# Altium project Nixie_IN12.PrjPcb
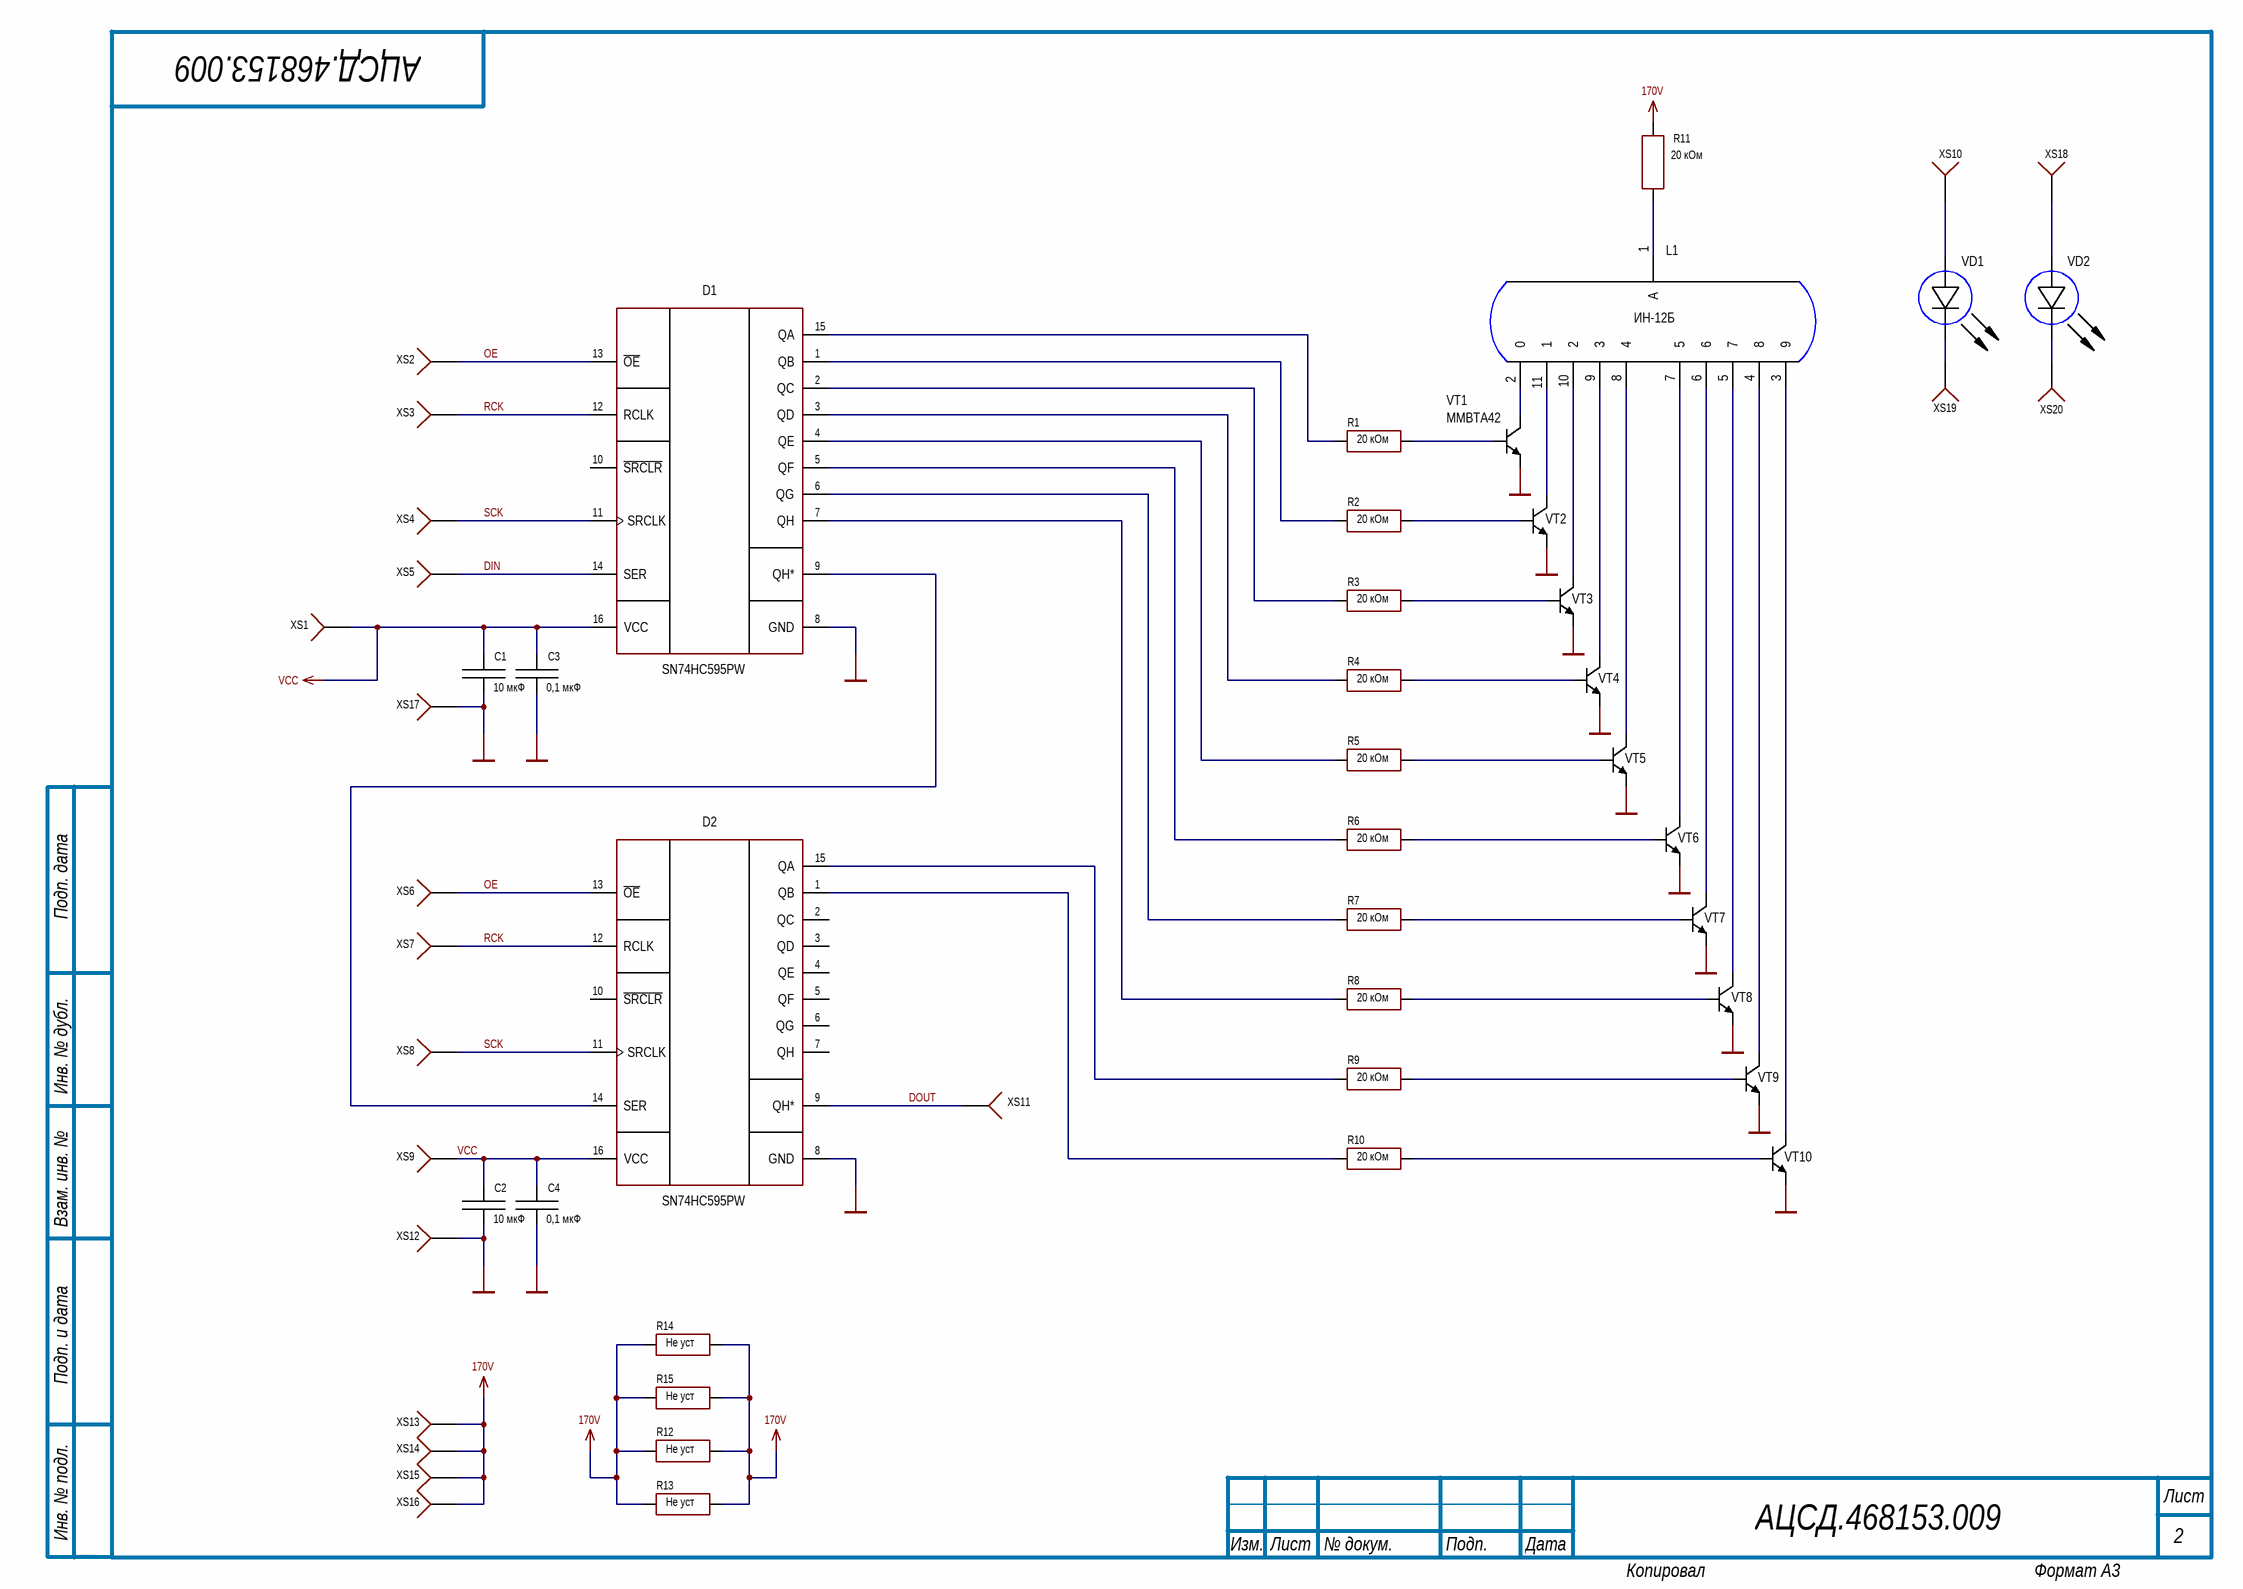
[diagram p0: Nixie_IN12.SchDoc]
Дата_изменения: 22.07.2020; Наименование: Плата управления; Наименование1: Плата управления; Наименование_PCB: Плата печатная; Обозначение: АЦСД.468153.009; Обозначение_PCB: АЦСД.758764.017; Обозначение_Код: АЦСД.468153.009; Перв.Примен.: АЦСД.468153.009; ПервПримен: АЦСД.468153.009; Раздел: Документация; Раздел_PCB: Документация; Формат_PCB: А4
1 sheet, 54 parts. Net scope: global (net labels, ports and power ports of the same name join across sheets).
Board file: Nixie_IN12.PcbDoc

## Sheet Nixie_IN12.SchDoc
size 420 x 297 mm; Date: 07.02.20; SheetNumber: 2; Title1str: {Наименование}; PageSetup: Record=PageOptions|CenterHorizontal=False|CenterVertical=False|PrintScale=0.95|XCorrection=0.00|YCorrection=0.00|PrintKind=1|BorderSize=5000000|LeftOffset=0|BottomOffset=0|Orientation=1|PaperLength=1000|PaperWidth=1000|Scale=100|PaperSource=15|PrintQuality=600|MediaType=1|DitherType=10|PaperKind=A4|PrintScaleMode=1; Title2str: {Наименование}; DocumentType: {Документ}; DocumentType1str: {Документ}; DocumentType2str: {Документ}

### Parts
C1  value 10 мкФ  [CAP: 0603R]
C2  value 10 мкФ  [CAP: 0603R]
C3  value 0,1 мкФ  [CAP: 0603R]
C4  value 0,1 мкФ  [CAP: 0603R]
D1  PartNumber: SN74HC595PW  [16-TSSOP(RS)]
D2  PartNumber: SN74HC595PW  [16-TSSOP(RS)]
L1  PartNumber: ИН-12Б  [LAMP: IN-12]  (hidden comment: ИН-12)
R1  value 20 кОм  [RES: 0603_ASK]
R2  value 20 кОм  [RES: 0603_ASK]
R3  value 20 кОм  [RES: 0603_ASK]
R4  value 20 кОм  [RES: 0603_ASK]
R5  value 20 кОм  [RES: 0603_ASK]
R6  value 20 кОм  [RES: 0603_ASK]
R7  value 20 кОм  [RES: 0603_ASK]
R8  value 20 кОм  [RES: 0603_ASK]
R9  value 20 кОм  [RES: 0603_ASK]
R10  value 20 кОм  [RES: 0603_ASK]
R11  value 20 кОм  [RES: 2010]
R12  value Не уст  [RES: 0603_ASK]
R13  value Не уст  [RES: 0603_ASK]
R14  value Не уст  [RES: 0603_ASK]
R15  value Не уст  [RES: 0603_ASK]
VD1  (no value)  [LED: XTEAWT]
VD2  (no value)  [LED: XTEAWT]
VT1  PartNumber: MMBTA42  [SOT23]
VT2  (no value)  [SOT23]
VT3  (no value)  [SOT23]
VT4  (no value)  [SOT23]
VT5  (no value)  [SOT23]
VT6  (no value)  [SOT23]
VT7  (no value)  [SOT23]
VT8  (no value)  [SOT23]
VT9  (no value)  [SOT23]
VT10  (no value)  [SOT23]
XS1  (no value)  [CON: PLD-1]
XS2  (no value)  [CON: PLD-1]
XS3  (no value)  [CON: PLD-1]
XS4  (no value)  [CON: PLD-1]
XS5  (no value)  [CON: PLD-1]
XS6  (no value)  [CON: PLD-1]
XS7  (no value)  [CON: PLD-1]
XS8  (no value)  [CON: PLD-1]
XS9  (no value)  [CON: PLD-1]
XS10  (no value)  [CON: PLD-1]
XS11  (no value)  [CON: PLD-1]
XS12  (no value)  [CON: PLD-1]
XS13  (no value)  [CON: PLD-1]
XS14  (no value)  [CON: PLD-1]
XS15  (no value)  [CON: PLD-1]
XS16  (no value)  [CON: PLD-1]
XS17  (no value)  [CON: PLD-1]
XS18  (no value)  [CON: PLD-1]
XS19  (no value)  [CON: PLD-1]
XS20  (no value)  [CON: PLD-1]

### Nets
170V: R11.2 R12.1 R12.2 R13.1 R13.2 R14.1 R14.2 R15.1 R15.2 XS13.1 XS14.1 XS15.1 XS16.1
GND: C1.1 C2.1 C3.1 C4.1 D1.8(GND) D2.8(GND) VT1.2(E) VT2.2(E) VT3.2(E) VT4.2(E) VT5.2(E) VT6.2(E) VT7.2(E) VT8.2(E) VT9.2(E) VT10.2(E) XS12.1 XS17.1
VCC: C1.2 C2.2 C3.2 C4.2 D1.16(VCC) D2.16(VCC) XS1.1 XS9.1
DIN: D1.14(SER) XS5.1
DOUT: D2.9(QH*) XS11.1
OE: D1.13(~{OE}) D2.13(~{OE}) XS2.1 XS6.1
RCK: D1.12(RCLK) D2.12(RCLK) XS3.1 XS7.1
SCK: D1.11(SRCLK) D2.11(SRCLK) XS4.1 XS8.1
NetD1_1: D1.1(QB) R2.2
NetD1_2: D1.2(QC) R3.2
NetD1_3: D1.3(QD) R4.2
NetD1_4: D1.4(QE) R5.2
NetD1_5: D1.5(QF) R6.2
NetD1_6: D1.6(QG) R7.2
NetD1_7: D1.7(QH) R8.2
NetD1_9: D1.9(QH*) D2.14(SER)
NetD1_15: D1.15(QA) R1.2
NetD2_1: D2.1(QB) R10.2
NetD2_15: D2.15(QA) R9.2
NetL1_1: L1.1(A) R11.1
NetL1_2: L1.2(0) VT1.3(C)
NetL1_3: L1.3(9) VT10.3(C)
NetL1_4: L1.4(8) VT9.3(C)
NetL1_5: L1.5(7) VT8.3(C)
NetL1_6: L1.6 VT7.3(C)
NetL1_7: L1.7(5) VT6.3(C)
NetL1_8: L1.8(4) VT5.3(C)
NetL1_9: L1.9(3) VT4.3(C)
NetL1_10: L1.10(2) VT3.3(C)
NetL1_11: L1.11(1) VT2.3(C)
NetR1_1: R1.1 VT1.1(B)
NetR2_1: R2.1 VT2.1(B)
NetR3_1: R3.1 VT3.1(B)
NetR4_1: R4.1 VT4.1(B)
NetR5_1: R5.1 VT5.1(B)
NetR6_1: R6.1 VT6.1(B)
NetR7_1: R7.1 VT7.1(B)
NetR8_1: R8.1 VT8.1(B)
NetR9_1: R9.1 VT9.1(B)
NetR10_1: R10.1 VT10.1(B)
NetVD1_1: VD1.1(A) XS10.1
NetVD1_2: VD1.2(C) XS19.1
NetVD2_1: VD2.1(A) XS18.1
NetVD2_2: VD2.2(C) XS20.1

Not connected (* = marked no-connect by the designer): D1 10(~{SRCLR}); D2 2(QC) 3(QD) 4(QE) 5(QF) 6(QG) 7(QH) 10(~{SRCLR})

### Notes on the sheet
- Подп. дата
- Инв. № дубл.
- Взам. инв. №
- Подп. и дата
- Инв. № подл.
- Изм.
- Лист
- № докум.
- Подп.
- Дата
- ALTIUM GOSTBOM2.0 KEV
- Копировал
- Формат А3

### Library data of the parts
C1 C2 = Ceramic_0603: Manufacturer: Yageo; ValueManufacturerPartNumber: Ceramic capacitor, 10 мкФ, X7R, ±10%, 16V, 0603, -55...+125°C; TypeCapacitor: Ceramic capacitor; Tolerance: ±10%; TypeDielectric: X7R; Voltage: 16V; Package: 0603; Temperature: -55...+125°C; Перечень: ="Value"+' '+"Tolerance"+', '+"Volt"+', '+"TypeDielectric"+',  '+"Package"
C3 C4 = Ceramic_0603: Manufacturer: Yageo; ValueManufacturerPartNumber: Ceramic capacitor, 0,1 мкФ, X7R, ±10%, 16V, 0603, -55...+125°C; TypeCapacitor: Ceramic capacitor; Tolerance: ±10%; TypeDielectric: X7R; Voltage: 16V; Package: 0603; Temperature: -55...+125°C; Перечень: ="Value"+' '+"Tolerance"+', '+"Volt"+', '+"TypeDielectric"+',  '+"Package"
D1 D2 = SN74HC595DB: 8-Bit Parallel-Out Serial Shift Registers; Manufacturer: Texas Instruments; Supply: 2...6V; Package: 16-TSSOP; Temperature: -40...+125°C
R1-R10 = Resistor_0603: Manufacturer: Yageo; PartNumber: RC0603JR-07100RL; ValueManufacturerPartNumber: Resistor film, 20 кОм, ±5%, 0603, 0.1W, -55...+125°C; TypeResistor: Resistor film; Power: 0.1W; Tolerance: ±5%; Package: 0603; HelpURL: https://www.digikey.com/product-detail/en/yageo/RC0603JR-07100RL/311-100GRCT-ND/729644; Temperature: -55...+125°C
R11 = Resistor_2010: Manufacturer: Yageo; PartNumber: RC2010JK-07100RL; ValueManufacturerPartNumber: Resistor film, 20 кОм, ±5%, 2010, 0.75W, -55...+125°C; TypeResistor: Resistor film; Power: 0.75W; Tolerance: ±5%; Package: 2010; HelpURL: https://www.digikey.com/product-detail/en/yageo/RC2010JK-07100RL/YAG3381CT-ND/5962203; Temperature: -55...+125°C
R12-R15 = Resistor_0603: Manufacturer: Yageo; PartNumber: RC0603JR-07100RL; ValueManufacturerPartNumber: Resistor film, Не уст, ±5%, 0603, 0.1W, -55...+125°C; TypeResistor: Resistor film; Power: 0.1W; Tolerance: ±5%; Package: 0603; HelpURL: https://www.digikey.com/product-detail/en/yageo/RC0603JR-07100RL/311-100GRCT-ND/729644; Temperature: -55...+125°C
VD1 VD2 = LED_Salut: Manufacturer: CREE; PartNumber: XTEAWT - E0 - 0000 - 00000BGE7; TypeDiode: LED; Maximum drive current: 2 A; Maximum V: 2.85 V; Package: XP-G2; HelpURL: https://cree-led.com/media/documents/XLampXTE.pdf; ValueManufacturerPartNumber: =TypeDiode+', '+Current+', '+VoltageDrop+', '+Package+', '+Temperature; Temperature: -55...+150°C
VT1 = BJT_NPN_132: Manufacturer: ON Semiconductor; ValueManufacturerPartNumber: NPN transistor, 45V, 100mA, 100MHz, 300mW, 0.6V, 420, SOT-23, -55...+125°C; TypeTransistor: NPN transistor; VoltageCE: 45V; CurrentCE: 100mA; VoltageSaturation: 0.6V; Frequency: 100MHz; CurrentGain: 420; MaxPower: 300mW; Package: SOT-23; HelpURL: https://www.digikey.com/product-detail/en/on-semiconductor/BC847CLT1G/BC847CLT1GOSCT-ND/917836; Temperature: -55...+125°C
VT2-VT10 = BJT_NPN_132: Manufacturer: ON Semiconductor; ValueManufacturerPartNumber: NPN transistor, 45V, 100mA, 100MHz, 300mW, 0.6V, 420, SOT-23, -55...+125°C; PartNumber: MMBTA42; TypeTransistor: NPN transistor; VoltageCE: 45V; CurrentCE: 100mA; VoltageSaturation: 0.6V; Frequency: 100MHz; CurrentGain: 420; MaxPower: 300mW; Package: SOT-23; HelpURL: https://www.digikey.com/product-detail/en/on-semiconductor/BC847CLT1G/BC847CLT1GOSCT-ND/917836; Temperature: -55...+125°C
XS1-XS20 = Контр.точка: Перечень: Элемент платы; TypeConnector: Connector; CurrentMax: 3A; Multichannel: 1pin